# Altium schematic sheet ESP32_RF.SchDoc
size A3; SheetNumber: 1; SheetTotal: 1
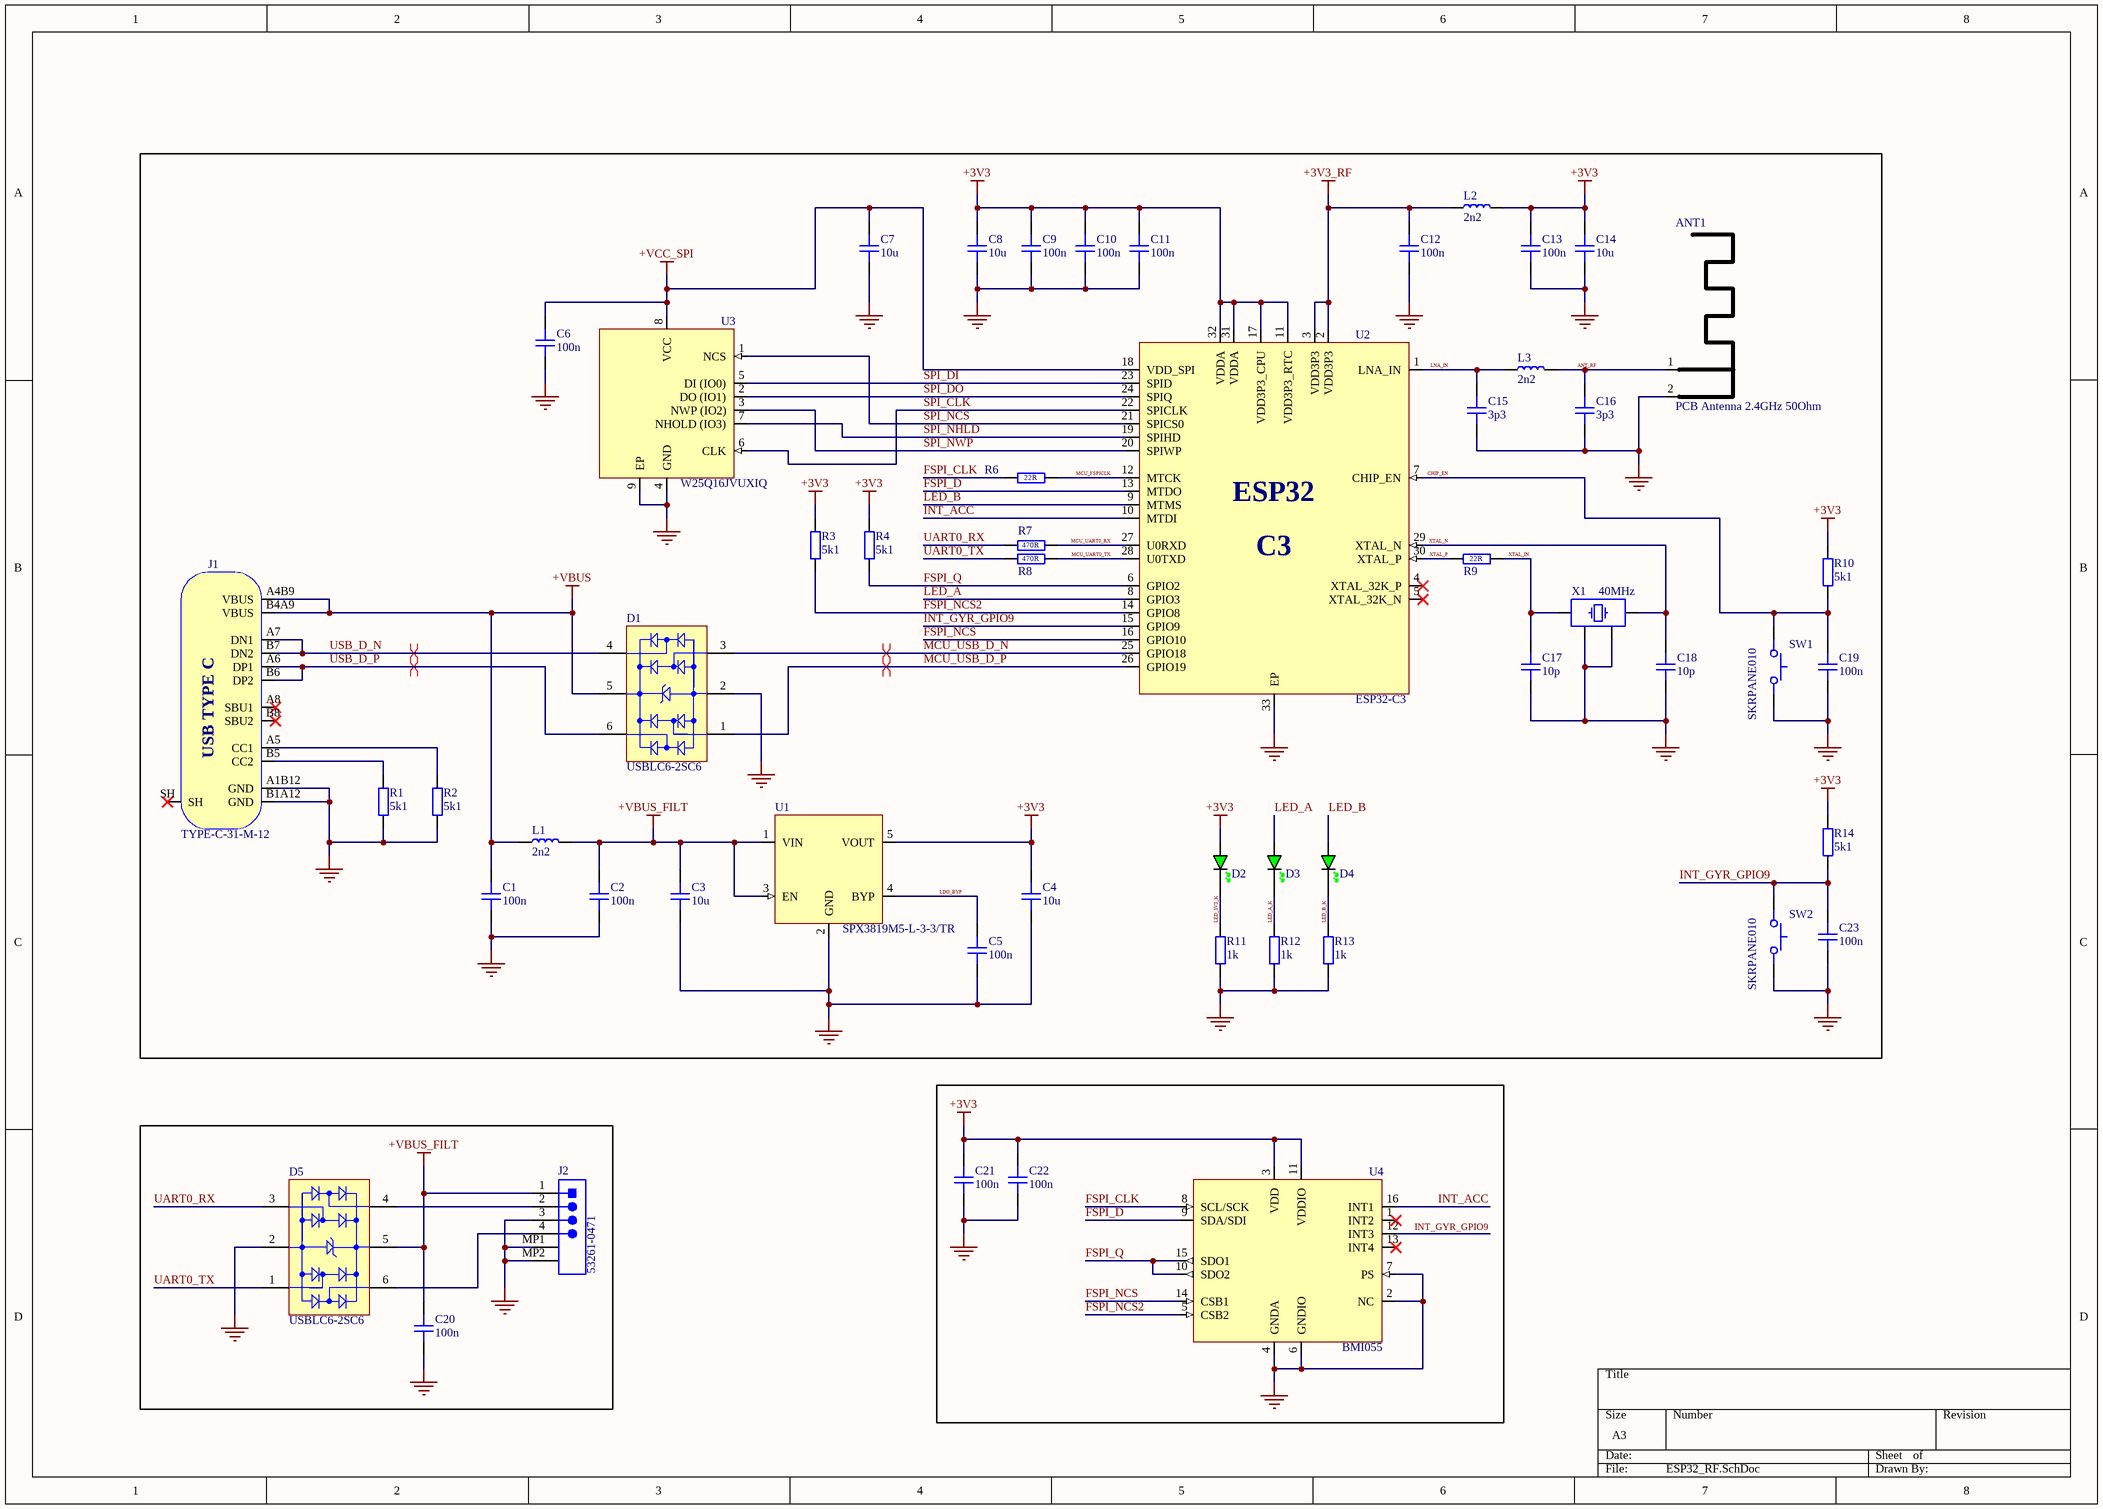
[diagram p0: ESP32_RF.SchDoc]

## Parts
ANT1  PCB Antenna 2.4GHz 50Ohm  [ANT_IFA_USB_2_4GHZ_50R]  (no BOM)
C1  100n  [CAP_0402]
C2  100n  [CAP_0402]
C3  10u  [CAP_0603]
C4  10u  [CAP_0603]
C5  100n  [CAP_0402]
C6  100n  [CAP_0402]
C7  10u  [CAP_0603]
C8  10u  [CAP_0603]
C9  100n  [CAP_0402]
C10  100n  [CAP_0402]
C11  100n  [CAP_0402]
C12  100n  [CAP_0402]
C13  100n  [CAP_0402]
C14  10u  [CAP_0603]
C15  3p3  [CAP_0402]
C16  3p3  [CAP_0402]
C17  10p  [CAP_0402]
C18  10p  [CAP_0402]
C19  100n  [CAP_0402]
C20  100n  [CAP_0402]
C21  100n  [CAP_0402]
C22  100n  [CAP_0402]
C23  100n  [CAP_0402]
D1  USBLC6-2SC6  [STM-SOT23-6L_V]
D2  GREEN  [LED_0603_GREEN]  (value not drawn)
D3  GREEN  [LED_0603_GREEN]  (value not drawn)
D4  GREEN  [LED_0603_GREEN]  (value not drawn)
D5  USBLC6-2SC6  [STM-SOT23-6L_V]
J1  TYPE-C-31-M-12  [TYPE-C-31-M-12]
J2  53261-0471  [MOLEX-53261-0471_V]
L1  2n2  [IND_0402]
L2  2n2  [IND_0402]
L3  2n2  [IND_0402]
R1  5k1  [RES_0402]
R2  5k1  [RES_0402]
R3  5k1  [RES_0402]
R4  5k1  [RES_0402]
R6  22R  [RES_0402]
R7  470R  [RES_0402]
R8  470R  [RES_0402]
R9  22R  [RES_0402]
R10  5k1  [RES_0402]
R11  1k  [RES_0402]
R12  1k  [RES_0402]
R13  1k  [RES_0402]
R14  5k1  [RES_0402]
SW1  SKRPANE010  [SKRPANE010]
SW2  SKRPANE010  [SKRPANE010]
U1  SPX3819M5-L-3-3/TR  [SOT-23-5]
U2  ESP32-C3  [QFN32-5x5]
U3  W25Q16JVUXIQ  [USON-8-2X3MM]
U4  BMI055  [BMI088]
X1  40MHz  [XTAL_2520]

## Nets
+3V3: C4.2 C8.2 C9.2 C10.2 C11.2 C13.2 C14.2 C21.2 C22.2 D2.A L2.1 R3.1 R4.1 R10.2 R14.2 U1.5(VOUT) U2.11(VDD3P3_RTC) U2.17(VDD3P3_CPU) U2.31(VDDA) U2.32(VDDA) U4.3(VDD) U4.11(VDDIO)
+3V3_RF: C12.2 L2.2 U2.2(VDD3P3) U2.3(VDD3P3)
+VBUS: C1.2 D1.5(VBUS) J1.A4B9(VBUS) J1.B4A9(VBUS) L1.2
+VBUS_FILT: C2.2 C3.2 C20.2 D5.5(VBUS) J2.1 L1.1 U1.1(VIN) U1.3(EN)
+VCC_SPI: C6.2 C7.2 U2.18(VDD_SPI) U3.8(VCC)
GND: ANT1.2(GND) C1.1 C2.1 C3.1 C4.1 C5.1 C6.1 C7.1 C8.1 C9.1 C10.1 C11.1 C12.1 C13.1 C14.1 C15.1 C16.1 C17.1 C18.1 C19.1 C20.1 C21.1 C22.1 C23.1 D1.2(GND) D5.2(GND) J1.A1B12(GND) J1.B1A12(GND) J2.3 J2.MP1 J2.MP2 R1.2 R2.2 R11.1 R12.1 R13.1 SW1.12 SW2.12 U1.2(GND) U2.33(EP) U3.4(GND) U3.9(EP) U4.2(NC) U4.4(GNDA) U4.6(GNDIO) U4.7(PS) X1.2 X1.4
ANT_RF: ANT1.1(RF) C16.2 L3.1
CHIP_EN: C19.2 R10.1 SW1.34 U2.7(CHIP_EN)
FSPI_CLK: R6.1 U4.8(SCL/SCK)
FSPI_D: U2.13(MTDO) U4.9(SDA/SDI)
FSPI_NCS: U2.16(GPIO10) U4.14(CSB1)
FSPI_NCS2: R3.2 U2.14(GPIO8) U4.5(CSB2)
FSPI_Q: R4.2 U2.6(GPIO2) U4.10(SDO2) U4.15(SDO1)
INT_ACC: U2.10(MTDI) U4.16(INT1)
INT_GYR_GPIO9: C23.2 R14.1 SW2.34 U2.15(GPIO9) U4.12(INT3)
LDO_BYP: C5.2 U1.4(BYP)
LED_3V3_K: D2.K R11.2
LED_A: D3.A U2.8(GPIO3)
LED_A_K: D3.K R12.2
LED_B: D4.A U2.9(MTMS)
LED_B_K: D4.K R13.2
LNA_IN: C15.2 L3.2 U2.1(LNA_IN)
MCU_FSPICLK: R6.2 U2.12(MTCK)
MCU_UART0_RX: R7.2 U2.27(U0RXD)
MCU_UART0_TX: R8.2 U2.28(U0TXD)
MCU_USB_D_N: D1.3(I/O_2) U2.25(GPIO18)
MCU_USB_D_P: D1.1(I/O_1) U2.26(GPIO19)
SPI_CLK: U2.22(SPICLK) U3.6(CLK)
SPI_DI: U2.23(SPID) U3.5(DI_(IO0))
SPI_DO: U2.24(SPIQ) U3.2(DO_(IO1))
SPI_NCS: U2.21(SPICS0) U3.1(NCS)
SPI_NHLD: U2.19(SPIHD) U3.7(NHOLD_(IO3))
SPI_NWP: U2.20(SPIWP) U3.3(NWP_(IO2))
UART0_RX: D5.3(I/O_2) R7.1
UART0_TX: D5.1(I/O_1) R8.1
USB_D_N: D1.4(I/O_3) J1.A7(DN1) J1.B7(DN2)
USB_D_P: D1.6(I/O_4) J1.A6(DP1) J1.B6(DP2)
XTAL_IN: C17.2 R9.2 X1.3
XTAL_N: C18.2 U2.29(XTAL_N) X1.1
XTAL_P: R9.1 U2.30(XTAL_P)
NetD5_4: D5.4(I/O_3) J2.2
NetD5_6: D5.6(I/O_4) J2.4
NetJ1_A5: J1.A5(CC1) R2.1
NetJ1_B5: J1.B5(CC2) R1.1

Not connected (* = marked no-connect by the designer): J1 A8(SBU1)* B8(SBU2)* SH*; U2 4(XTAL_32K_P)* 5(XTAL_32K_N)*; U4 1(INT2)* 13(INT4)*

## Layout directives
differential pair; differential pair class DIFF_USB: MCU_USB_D_N, MCU_USB_D_P, USB_D_N, USB_D_P

## Notes on the sheet
- (in symbol ESP32-C3) ESP32; C3
- (in symbol TYPE-C-31-M-12) USB TYPE C

## Library data of the parts
ANT1 = ANT_IFA_USB_2_4GHZ_50R: Inverted F 2.4GHz ISM PCB Antenna 50 Ohm; ComponentLink1Description: Datasheet; ComponentLink1URL: https://www.ti.com/lit/an/swra117d/swra117d.pdf
C1 C2 C5 C6 C9-C13 C19-C23 = CAP_0402_50V: Capacitor SMD 0402 50V; Manufacturer: Samsung; Manufacturer Part Number: CL05B104KO5NNNC; LCSC: C1525
C3 C4 C7 C8 C14 = CAP_0603_10V: Capacitor SMD 0603 10V; Manufacturer: Samsung; Manufacturer Part Number: CL10A106KP8NNNC; LCSC: C19702
C15 C16 = CAP_0402_50V: Capacitor SMD 0402 50V; Manufacturer: FH; Manufacturer Part Number: 0402CG3R3C500NT; LCSC: C1565
C17 C18 = CAP_0402_50V: Capacitor SMD 0402 50V; Manufacturer: Samsung; Manufacturer Part Number: CL05C100JB5NNNC; LCSC: C32949
D1 D5 = CMP-2000-05378-1: Very low capacitance ESD protection, 3.5 pF, -40 to 125 degC, 6-Pin SOT23, RoHS, Tape and Reel; Manufacturer: STMicroelectronics; Polarity: Uni-Directional; Clamping Voltage: 17V; Rad Hardened: No; Product Height (mm): 1.3mm; Leakage Current (Max): 0.15uA; Product Length (mm): 3.05mm; Number of Elements: 1; Peak Pulse Current: 5A; Configuration: Dual; Reverse Breakdown Voltage: 6V; Working Voltage (Max): 5V; Capacitance Value: 3.5pF; Suppressor Type: DiodeArrays; Product Depth (mm): 1.75mm; Test Current (It): 1mA; Package / Case: SOT-23; Operating Temperature Max Deg. C: 125C; Package Description: 6-Pin Small Outline Transistor, Body 2.925 x 1.625 mm, Pitch 0.95 mm; Package Reference: SOT23-6L; Datasheet Version: Rev. 5, 10/2011; Operating Temperature Min Deg. C: -40C; Mounting Style: SurfaceMount; Direction Type: Uni-Directional; Mounting: SurfaceMount; Pin Count: 6; Leakage Current: 0.15uA; Packaging: TapeandReel; Operating Temperature Classification: Automotive; Clamping Voltage (Max): 17V; Manufacturer URL: http://www.st.com/; Reverse Stand-off Voltage: 5V; Datasheet URL: http://www.st.com/st-web-ui/static/active/en/resource/technical/document/datasheet/CD00050750.pdf; Working Voltage: 5V; Operating Temp Range: -40Cto125C; LCSC: C7519
D2-D4 = LED_0603_GREEN: LED 0603 GREEN SMD; LCSC: C72043
J1 = TYPE-C-31-M-12: USB Type C Connector Horizontal SMT; Manufacturer: Koren Hroparts; Manufacturer Part Number: TYPE-C-31-M-12; LCSC: C165948
J2 = CMP-2000-05238-1: Male Header, Pitch 1.25 mm, 1 x 4 Position, Height 3.4 mm, -40 to 85 degC, RoHS, Tape and Reel; Current Rating: 1A; Brand: Molex; Number of Positions / Contacts: 4; Pitch: 1.25mm; Voltage Rating: 125V; Mounting Angle: Right; Manufacturer URL: http://www.molex.com/; Factory Pack Quantity: 1000; Housing Material: Thermoplastic; Datasheet URL: http://www.molex.com/pdm_docs/sd/532610471_sd.pdf; Tradename: PicoBlade; Product Type: Headers; Contact Plating: Tin; Contact Material: PhosphorBronze; Package Description: 1.25mm Pitch PicoBlade(TM) Header, Surface Mount, Right Angle, Lead-Free, 4 Circuits; Mounting Style: SMD/SMT; Manufacturer: Molex; Series: 53261; Packaging: Reel; Number of Rows: 1; RoHS: Details; Number of Positions: 4; Product Category: Headers&WireHousings; Datasheet Version: Rev. G, 01/2012; Type: Shrouded; Termination Style: SMD; LCSC: C240847
L1-L3 = IND_0402: Inductor SMD 0402; Manufacturer: Murata; Manufacturer Part Number: LQW15AN2N2G80D; LCSC: C412264
R1-R4 R10 R14 = RES_0402: Resistor SMD 0402; Manufacturer: YAGEO; Manufacturer Part Number: RC0402JR-075K1L; LCSC: C105873
R6 R9 = RES_0402: Resistor SMD 0402; Manufacturer: UNI-ROYAL; Manufacturer Part Number: 0402WGF220JTCE; LCSC: C25092
R7 R8 R11-R13 = RES_0402: Resistor SMD 0402; Manufacturer: UNI-ROYAL; Manufacturer Part Number: 0402WGF4700TCE; LCSC: C25117
SW1 SW2 = SKRPANE010: Tactile Switch SMD SPST; Manufacturer: Alps Alpine; Manufacturer Part Number: SKRPANE010; LCSC: C470426
U1 = SPX3819M5-L-3-3/TR: 500mA +3.3V Low-Noise LDO Voltage Regulator; Manufacturer: MaxLinear; Manufacturer Part Number: SPX3819M5-L-3-3/TR; LCSC: C9055
U2 = ESP32-C3: Ultra­Low­Power SoC with RISC­V Single­Core CPU Supporting IEEE 802.11b/g/n (2.4 GHz Wi­Fi) and Bluetooth® 5 (LE); Manufacturer: Espressif; Manufacturer Part Number: ESP32-C3; LCSC: C2838500
U3 = W25Q16JVUXIQ: 16M-BIT SERIAL FLASH MEMORY WITH / DUAL/QUAD SPI USON-8; Manufacturer: Winbond; Manufacturer Part Number: W25Q16JVUXIQ; LCSC: C2843335
U4 = BMI055: Inertial Measurement Unit IMU 6-Axis LGA; Manufacturer: Bosch; Manufacturer Part Number: BMI055; LCSC: C189620
X1 = XTAL_2520: Crystal SMD 2520; Manufacturer: Seiko Epson; Manufacturer Number: Q24FA20H0020900; Frequency: 40MHz; LCSC: C255973